# EAGLE design pi (EAGLE 9.4.2)

## Sheet 1 of 3
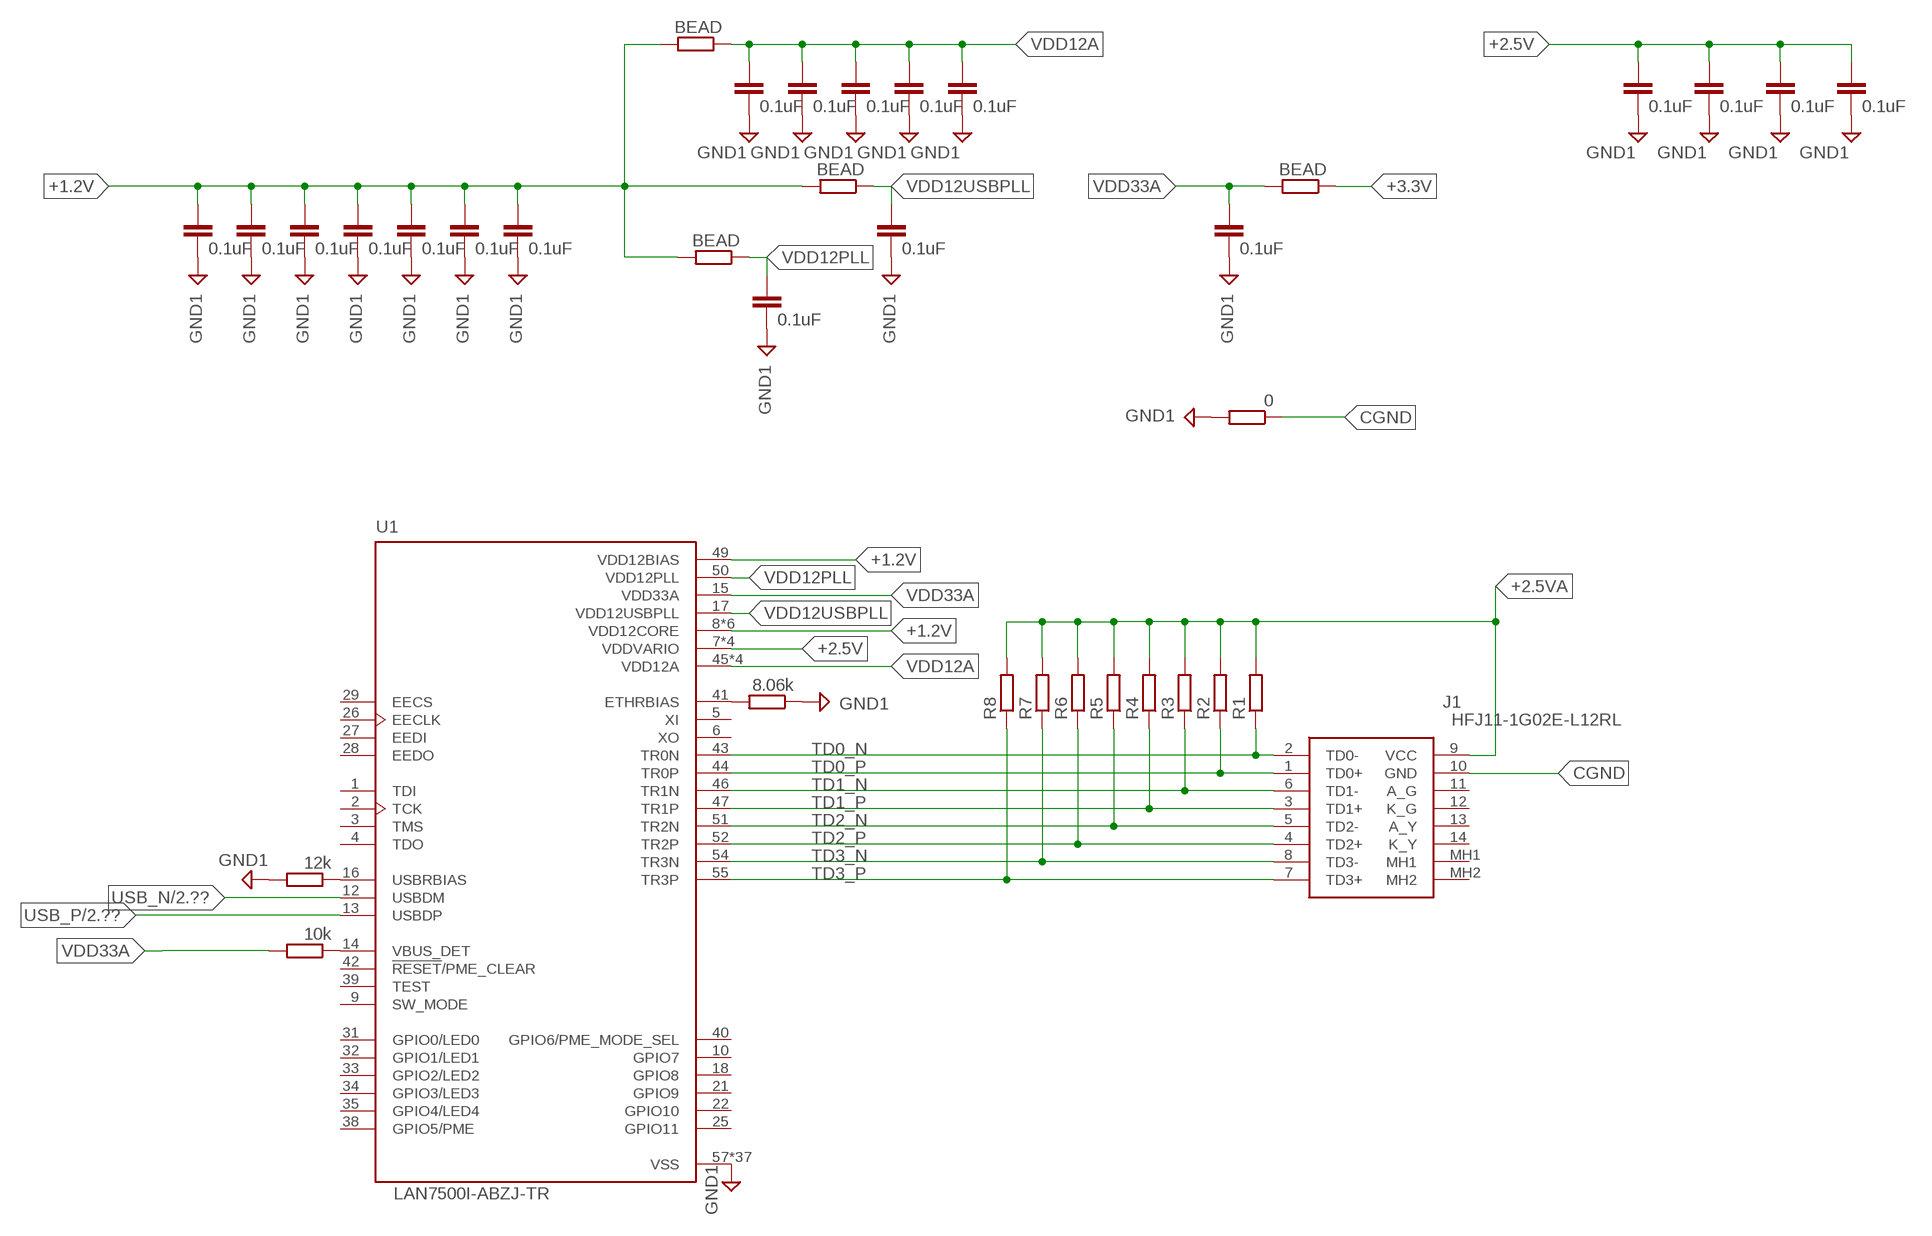
[diagram p0: schematic, sheet 1]

### Parts
C1  0.1uF  C-EUC0603K  [C0603K]
C2  0.1uF  C-EUC0603K  [C0603K]
C3  0.1uF  C-EUC0603K  [C0603K]
C4  0.1uF  C-EUC0603K  [C0603K]
C5  0.1uF  C-EUC0603K  [C0603K]
C6  0.1uF  C-EUC0603K  [C0603K]
C7  0.1uF  C-EUC0603K  [C0603K]
C8  0.1uF  C-EUC0603K  [C0603K]
C9  0.1uF  C-EUC0603K  [C0603K]
C10  0.1uF  C-EUC0603K  [C0603K]
C11  0.1uF  C-EUC0603K  [C0603K]
C12  0.1uF  C-EUC0603K  [C0603K]
C13  0.1uF  C-EUC0603K  [C0603K]
C14  0.1uF  C-EUC0603K  [C0603K]
C15  0.1uF  C-EUC0603K  [C0603K]
C16  0.1uF  C-EUC0603K  [C0603K]
C17  0.1uF  C-EUC0603K  [C0603K]
C18  0.1uF  C-EUC0603K  [C0603K]
C19  0.1uF  C-EUC0603K  [C0603K]
J1  HFJ11-1G02E-L12RL  [HFJ111G02EL12RL]
R1  R-EU_MELF0204R  [MINI_MELF-0204R]
R2  R-EU_MELF0204R  [MINI_MELF-0204R]
R3  R-EU_MELF0204R  [MINI_MELF-0204R]
R4  R-EU_MELF0204R  [MINI_MELF-0204R]
R5  R-EU_MELF0204R  [MINI_MELF-0204R]
R6  R-EU_MELF0204R  [MINI_MELF-0204R]
R7  R-EU_MELF0204R  [MINI_MELF-0204R]
R8  R-EU_MELF0204R  [MINI_MELF-0204R]
R9  8.06k  R-EU_MELF0204R  [MINI_MELF-0204R]
R10  12k  R-EU_MELF0204R  [MINI_MELF-0204R]
R11  10k  R-EU_MELF0204R  [MINI_MELF-0204R]
R12  BEAD  R-EU_MELF0204R  [MINI_MELF-0204R]
R13  BEAD  R-EU_MELF0204R  [MINI_MELF-0204R]
R14  BEAD  R-EU_MELF0204R  [MINI_MELF-0204R]
R15  0  R-EU_MELF0204R  [MINI_MELF-0204R]
R16  BEAD  R-EU_MELF0204R  [MINI_MELF-0204R]
U1  LAN7500I-ABZJ-TR  [QFN50P800X800X100-57N]

### Nets
+1.2V: C4.1 C5.1 C6.1 C7.1 C8.1 C9.1 C19.1 R12.2 R13.2 R16.2 U1.8(VDD12CORE) U1.11(VDD12CORE) U1.20(VDD12CORE) U1.23(VDD12CORE) U1.30(VDD12CORE) U1.36(VDD12CORE) U1.49(VDD12BIAS)
+2.5V: C15.1 C16.1 C17.1 C18.1 U1.7(VDDVARIO) U1.19(VDDVARIO) U1.24(VDDVARIO) U1.37(VDDVARIO)
+2.5VA: J1.9(VCC) R1.2 R2.2 R3.2 R4.2 R5.2 R6.2 R7.2 R8.2
+3.3V: R14.1
CGND: J1.10(GND) R15.1
GND1: C1.2 C2.2 C3.2 C4.2 C5.2 C6.2 C7.2 C8.2 C9.2 C10.2 C11.2 C12.2 C13.2 C14.2 C15.2 C16.2 C17.2 C18.2 C19.2 R9.1 R10.2 R15.2 U1.57(VSS) U1.V1(VSS) U1.V2(VSS) U1.V3(VSS) U1.V4(VSS) U1.V5(VSS) U1.V6(VSS) U1.V7(VSS) U1.V8(VSS) U1.V9(VSS) U1.V10(VSS) U1.V11(VSS) U1.V12(VSS) U1.V13(VSS) U1.V14(VSS) U1.V15(VSS) U1.V16(VSS) U1.V17(VSS) U1.V18(VSS) U1.V19(VSS) U1.V20(VSS) U1.V21(VSS) U1.V22(VSS) U1.V23(VSS) U1.V24(VSS) U1.V25(VSS) U1.V26(VSS) U1.V27(VSS) U1.V28(VSS) U1.V29(VSS) U1.V30(VSS) U1.V31(VSS) U1.V32(VSS) U1.V33(VSS) U1.V34(VSS) U1.V35(VSS) U1.V36(VSS)
N$1: R9.2 U1.41(ETHRBIAS)
N$2: R10.1 U1.16(USBRBIAS)
N$3: R11.1 U1.14(VBUS_DET)
TD0_N: J1.2(TD0-) R1.1 U1.43(TR0N)
TD0_P: J1.1(TD0+) R2.1 U1.44(TR0P)
TD1_N: J1.6(TD1-) R3.1 U1.46(TR1N)
TD1_P: J1.3(TD1+) R4.1 U1.47(TR1P)
TD2_N: J1.5(TD2-) R5.1 U1.51(TR2N)
TD2_P: J1.4(TD2+) R6.1 U1.52(TR2P)
TD3_N: J1.8(TD3-) R7.1 U1.54(TR3N)
TD3_P: J1.7(TD3+) R8.1 U1.55(TR3P)
USB_N: U1.12(USBDM) ; also sheet 2
USB_P: U1.13(USBDP) ; also sheet 2
VDD12A: C10.1 C11.1 C12.1 C13.1 C14.1 R16.1 U1.45(VDD12A) U1.48(VDD12A) U1.53(VDD12A) U1.56(VDD12A)
VDD12PLL: C2.1 R13.1 U1.50(VDD12PLL)
VDD12USBPLL: C1.1 R12.1 U1.17(VDD12USBPLL)
VDD33A: C3.1 R11.2 R14.2 U1.15(VDD33A)
Unconnected: J1.11(A_G) J1.12(K_G) J1.13(A_Y) J1.14(K_Y) J1.MH1 J1.MH2 U1.1(TDI) U1.2(TCK) U1.3(TMS) U1.4(TDO) U1.5(XI) U1.6(XO) U1.9(SW_MODE) U1.10(GPIO7) U1.18(GPIO8) U1.21(GPIO9) U1.22(GPIO10) U1.25(GPIO11) U1.26(EECLK) U1.27(EEDI) U1.28(EEDO) U1.29(EECS) U1.31(GPIO0/LED0) U1.32(GPIO1/LED1) U1.33(GPIO2/LED2) U1.34(GPIO3/LED3) U1.35(GPIO4/LED4) U1.38(GPIO5/PME) U1.39(TEST) U1.40(GPIO6/PME_MODE_SEL) U1.42(!RESET!/PME_CLEAR)

## Sheet 2 of 3
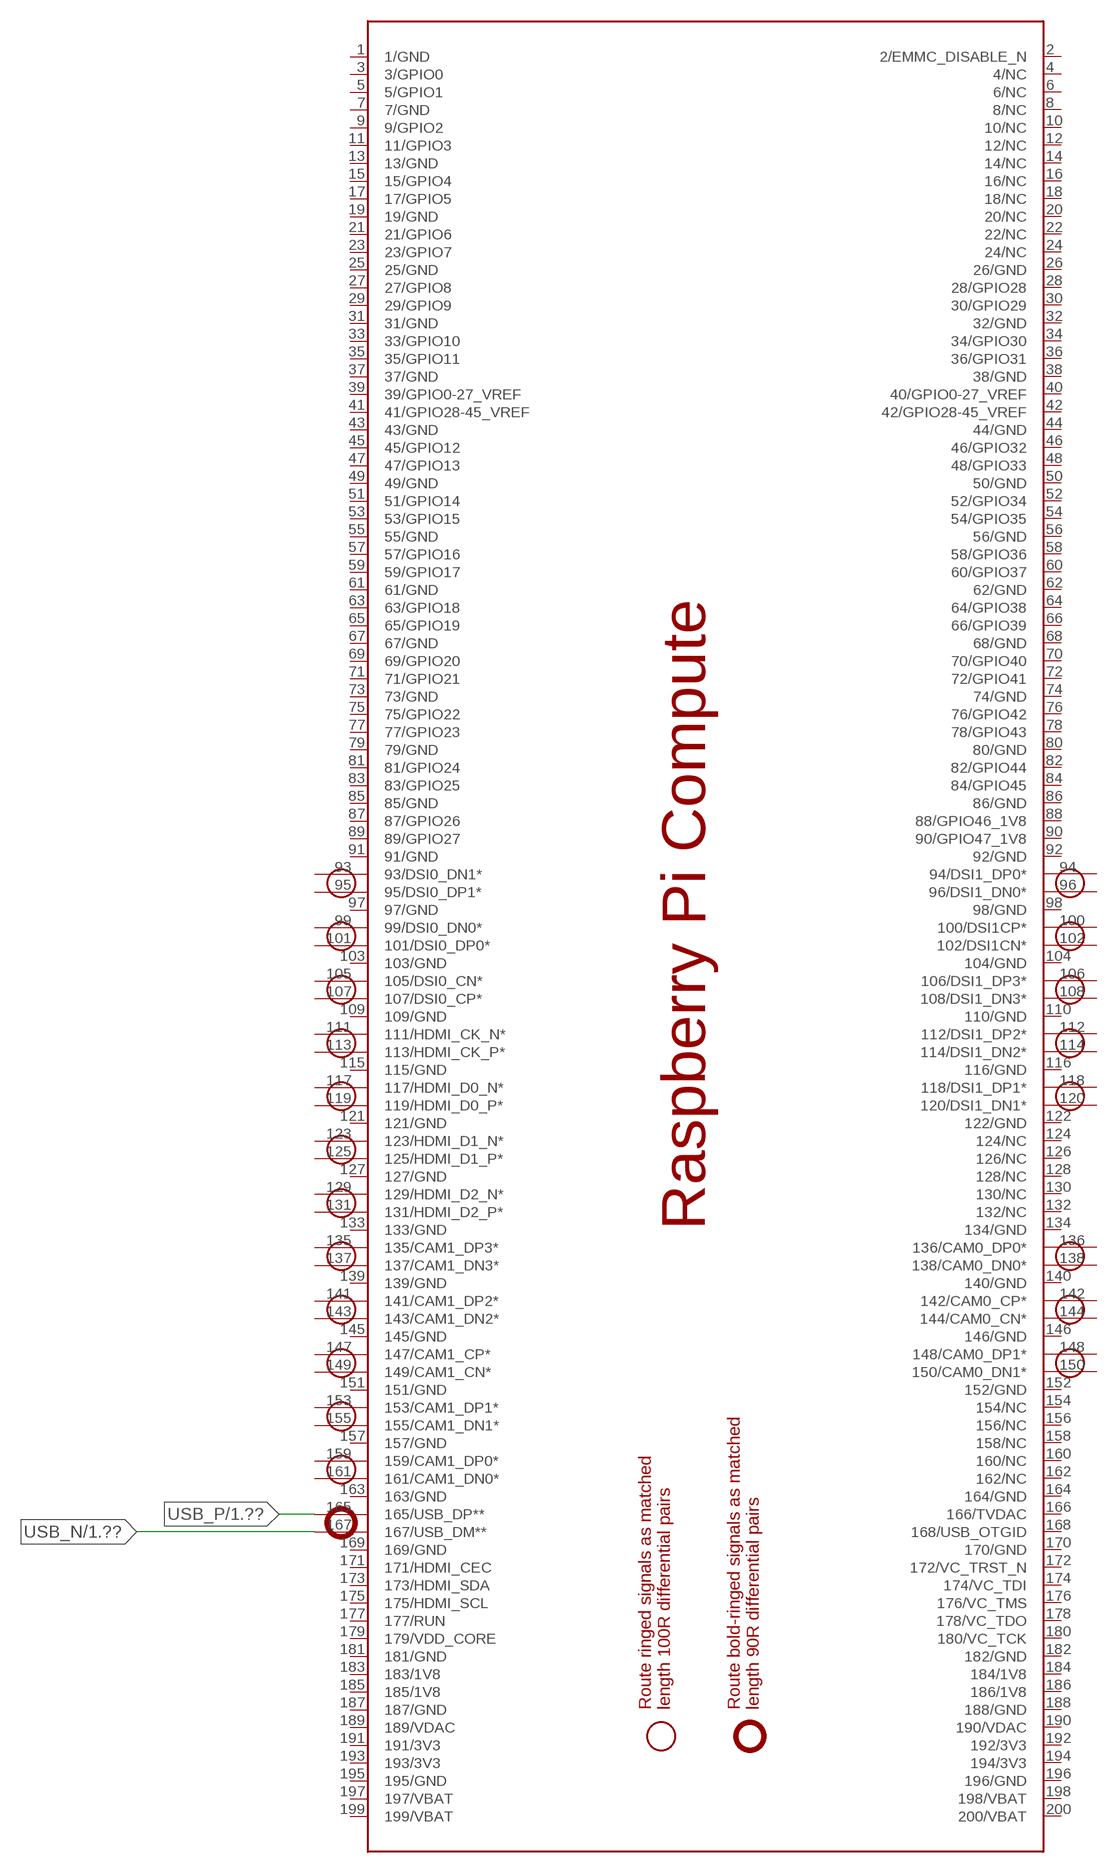
[diagram p1: schematic, sheet 2]

### Parts
PCB1  RPI_COMPUTE  [RPI_COMPUTE]

### Nets
USB_N: PCB1.167(167/USB_DM**) ; also sheet 1
USB_P: PCB1.165(165/USB_DP**) ; also sheet 1
Unconnected: PCB1.1(1/GND) PCB1.2(2/EMMC_DISABLE_N) PCB1.3(3/GPIO0) PCB1.4(4/NC) PCB1.5(5/GPIO1) PCB1.6(6/NC) PCB1.7(7/GND) PCB1.8(8/NC) PCB1.9(9/GPIO2) PCB1.10(10/NC) PCB1.11(11/GPIO3) PCB1.12(12/NC) PCB1.13(13/GND) PCB1.14(14/NC) PCB1.15(15/GPIO4) PCB1.16(16/NC) PCB1.17(17/GPIO5) PCB1.18(18/NC) PCB1.19(19/GND) PCB1.20(20/NC) PCB1.21(21/GPIO6) PCB1.22(22/NC) PCB1.23(23/GPIO7) PCB1.24(24/NC) PCB1.25(25/GND) PCB1.26(26/GND) PCB1.27(27/GPIO8) PCB1.28(28/GPIO28) PCB1.29(29/GPIO9) PCB1.30(30/GPIO29) PCB1.31(31/GND) PCB1.32(32/GND) PCB1.33(33/GPIO10) PCB1.34(34/GPIO30) PCB1.35(35/GPIO11) PCB1.36(36/GPIO31) PCB1.37(37/GND) PCB1.38(38/GND) PCB1.39(39/GPIO0-27_VREF) PCB1.40(40/GPIO0-27_VREF) PCB1.41(41/GPIO28-45_VREF) PCB1.42(42/GPIO28-45_VREF) PCB1.43(43/GND) PCB1.44(44/GND) PCB1.45(45/GPIO12) PCB1.46(46/GPIO32) PCB1.47(47/GPIO13) PCB1.48(48/GPIO33) PCB1.49(49/GND) PCB1.50(50/GND) PCB1.51(51/GPIO14) PCB1.52(52/GPIO34) PCB1.53(53/GPIO15) PCB1.54(54/GPIO35) PCB1.55(55/GND) PCB1.56(56/GND) PCB1.57(57/GPIO16) PCB1.58(58/GPIO36) PCB1.59(59/GPIO17) PCB1.60(60/GPIO37) PCB1.61(61/GND) PCB1.62(62/GND) PCB1.63(63/GPIO18) PCB1.64(64/GPIO38) PCB1.65(65/GPIO19) PCB1.66(66/GPIO39) PCB1.67(67/GND) PCB1.68(68/GND) PCB1.69(69/GPIO20) PCB1.70(70/GPIO40) PCB1.71(71/GPIO21) PCB1.72(72/GPIO41) PCB1.73(73/GND) PCB1.74(74/GND) PCB1.75(75/GPIO22) PCB1.76(76/GPIO42) PCB1.77(77/GPIO23) PCB1.78(78/GPIO43) PCB1.79(79/GND) PCB1.80(80/GND) PCB1.81(81/GPIO24) PCB1.82(82/GPIO44) PCB1.83(83/GPIO25) PCB1.84(84/GPIO45) PCB1.85(85/GND) PCB1.86(86/GND) PCB1.87(87/GPIO26) PCB1.88(88/GPIO46_1V8) PCB1.89(89/GPIO27) PCB1.90(90/GPIO47_1V8) PCB1.91(91/GND) PCB1.92(92/GND) PCB1.93(93/DSI0_DN1*) PCB1.94(94/DSI1_DP0*) PCB1.95(95/DSI0_DP1*) PCB1.96(96/DSI1_DN0*) PCB1.97(97/GND) PCB1.98(98/GND) PCB1.99(99/DSI0_DN0*) PCB1.100(100/DSI1CP*) PCB1.101(101/DSI0_DP0*) PCB1.102(102/DSI1CN*) PCB1.103(103/GND) PCB1.104(104/GND) PCB1.105(105/DSI0_CN*) PCB1.106(106/DSI1_DP3*) PCB1.107(107/DSI0_CP*) PCB1.108(108/DSI1_DN3*) PCB1.109(109/GND) PCB1.110(110/GND) PCB1.111(111/HDMI_CK_N*) PCB1.112(112/DSI1_DP2*) PCB1.113(113/HDMI_CK_P*) PCB1.114(114/DSI1_DN2*) PCB1.115(115/GND) PCB1.116(116/GND) PCB1.117(117/HDMI_D0_N*) PCB1.118(118/DSI1_DP1*) PCB1.119(119/HDMI_D0_P*) PCB1.120(120/DSI1_DN1*) PCB1.121(121/GND) PCB1.122(122/GND) PCB1.123(123/HDMI_D1_N*) PCB1.124(124/NC) PCB1.125(125/HDMI_D1_P*) PCB1.126(126/NC) PCB1.127(127/GND) PCB1.128(128/NC) PCB1.129(129/HDMI_D2_N*) PCB1.130(130/NC) PCB1.131(131/HDMI_D2_P*) PCB1.132(132/NC) PCB1.133(133/GND) PCB1.134(134/GND) PCB1.135(135/CAM1_DP3*) PCB1.136(136/CAM0_DP0*) PCB1.137(137/CAM1_DN3*) PCB1.138(138/CAM0_DN0*) PCB1.139(139/GND) PCB1.140(140/GND) PCB1.141(141/CAM1_DP2*) PCB1.142(142/CAM0_CP*) PCB1.143(143/CAM1_DN2*) PCB1.144(144/CAM0_CN*) PCB1.145(145/GND) PCB1.146(146/GND) PCB1.147(147/CAM1_CP*) PCB1.148(148/CAM0_DP1*) PCB1.149(149/CAM1_CN*) PCB1.150(150/CAM0_DN1*) PCB1.151(151/GND) PCB1.152(152/GND) PCB1.153(153/CAM1_DP1*) PCB1.154(154/NC) PCB1.155(155/CAM1_DN1*) PCB1.156(156/NC) PCB1.157(157/GND) PCB1.158(158/NC) PCB1.159(159/CAM1_DP0*) PCB1.160(160/NC) PCB1.161(161/CAM1_DN0*) PCB1.162(162/NC) PCB1.163(163/GND) PCB1.164(164/GND) PCB1.166(166/TVDAC) PCB1.168(168/USB_OTGID) PCB1.169(169/GND) PCB1.170(170/GND) PCB1.171(171/HDMI_CEC) PCB1.172(172/VC_TRST_N) PCB1.173(173/HDMI_SDA) PCB1.174(174/VC_TDI) PCB1.175(175/HDMI_SCL) PCB1.176(176/VC_TMS) PCB1.177(177/RUN) PCB1.178(178/VC_TDO) PCB1.179(179/VDD_CORE) PCB1.180(180/VC_TCK) PCB1.181(181/GND) PCB1.182(182/GND) PCB1.183(183/1V8) PCB1.184(184/1V8) PCB1.185(185/1V8) PCB1.186(186/1V8) PCB1.187(187/GND) PCB1.188(188/GND) PCB1.189(189/VDAC) PCB1.190(190/VDAC) PCB1.191(191/3V3) PCB1.192(192/3V3) PCB1.193(193/3V3) PCB1.194(194/3V3) PCB1.195(195/GND) PCB1.196(196/GND) PCB1.197(197/VBAT) PCB1.198(198/VBAT) PCB1.199(199/VBAT) PCB1.200(200/VBAT)

## Sheet 3 of 3
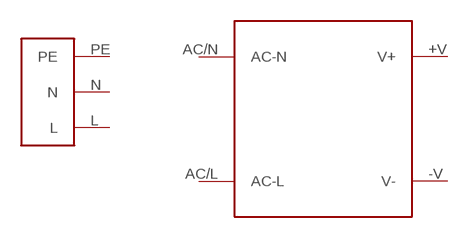
[diagram p2: schematic, sheet 3]

### Parts
U$1  DD21  [DD21.NOCOVER]
U$2  IRM-15-5  [IRM-15]
Unconnected: U$1.L U$1.N U$1.PE U$2.+V(V+) U$2.-V(V-) U$2.AC/L(AC-L) U$2.AC/N(AC-N)

## Library data of the parts
C1-C19 = Vwvwbg:C-EU: CAPACITOR, European symbol
J1 = Vwvwbg:HFJ11-1G02E-L12RL: Modular Connectors / Ethernet Connectors GIGABIT 1x1 Tab Down RJ45 w/mag Y/G LED Source: Datasheet <https://componentsearchengine.com/Datasheets/1/HFJ11-1G02E-L12RL.pdf>; ARROW_PART_NUMBER: HFJ11-1G02E-L12RL; DESCRIPTION: Modular Connectors / Ethernet Connectors GIGABIT 1x1 Tab Down RJ45 w/mag Y/G LED; HEIGHT: 13.64mm; MANUFACTURER_NAME: Halo Electronics; MANUFACTURER_PART_NUMBER: HFJ11-1G02E-L12RL; MOUSER_PART_NUMBER: 493-HFJ111G02EL12RL; MOUSER_PRICE-STOCK: https://www.mouser.co.uk/ProductDetail/HALO-Electronics/HFJ11-1G02E-L12RL?qs=8uu3sA0mUduADOHhIelkvg%3D%3D
PCB1 = Vwvwbg:RPI_COMPUTE: Device for a Raspberry PI Compute module. Note that the package is for a DDR2 connector of 'standard' orientation. Example: TE Connectivity P/N: 1565917-4, Newark P/N: 08P0616, Farnell P/N: 2112525 More information is available at http://www.element14.com/community/community/raspberry-pi/raspberry-pi-compute-module
R1-R16 = Vwvwbg:R-EU_: RESISTOR, European symbol
U1 = Vwvwbg:LAN7500I-ABZJ-TR: Hi-Speed USB 2.0 to 10/100/1000 Ethernet, 56 VQFN 8x8x0.9mm T/R; AVAILABILITY: Unavailable; DESCRIPTION: Ethernet Bridge, USB to Ethernet USB 2.0, 10/100/1000 Base-T/TX USB Interface 56-QFN (8x8); MF: Microchip; MP: LAN7500I-ABZJ-TR; PACKAGE: QFN-56 Microchip; PRICE: None
U$1 = Vwvwbg:DD21
U$2 = Vwvwbg:IRM-15-5

## Board
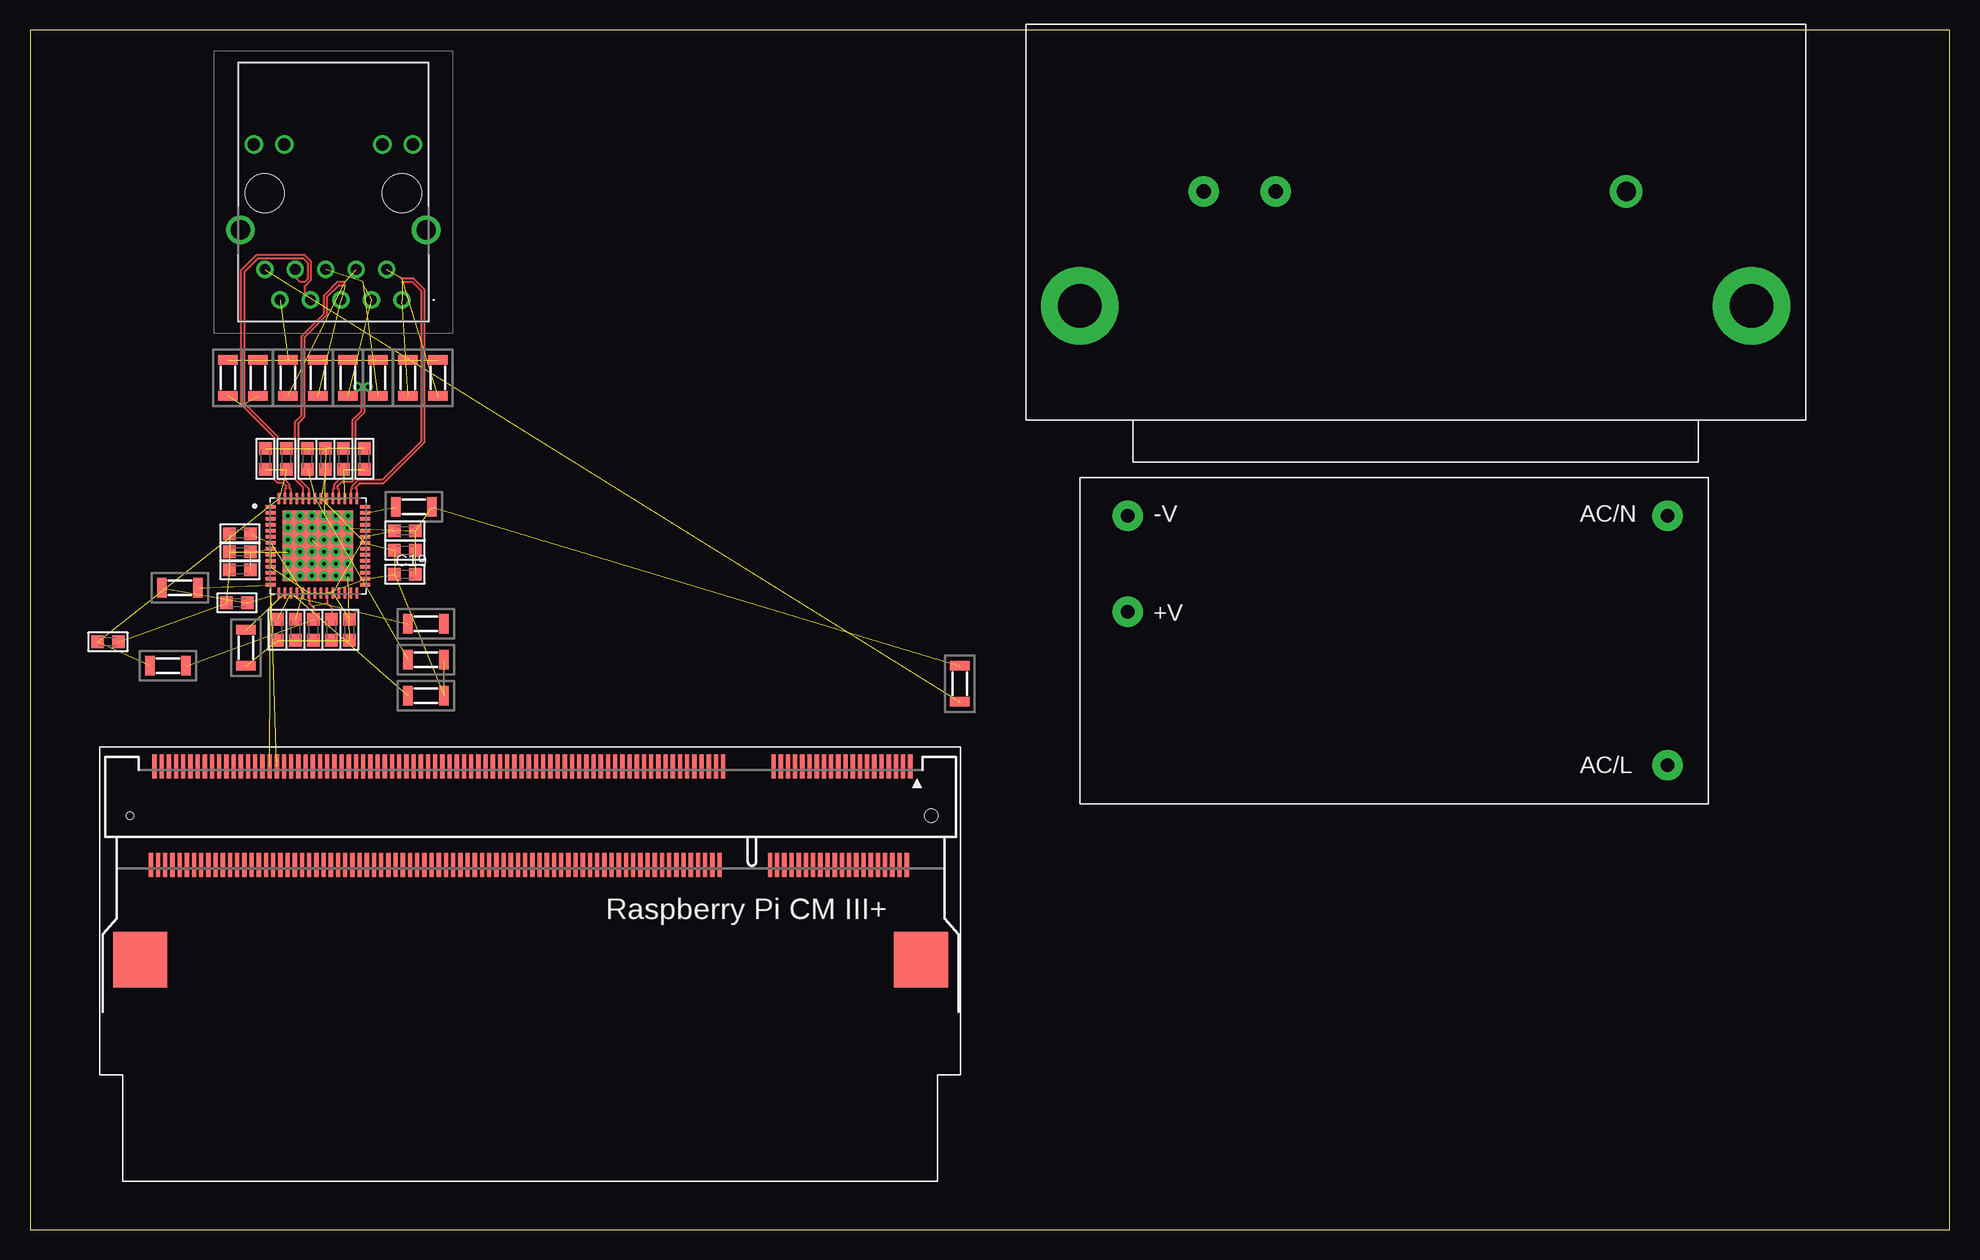
[diagram p3: board, top side]
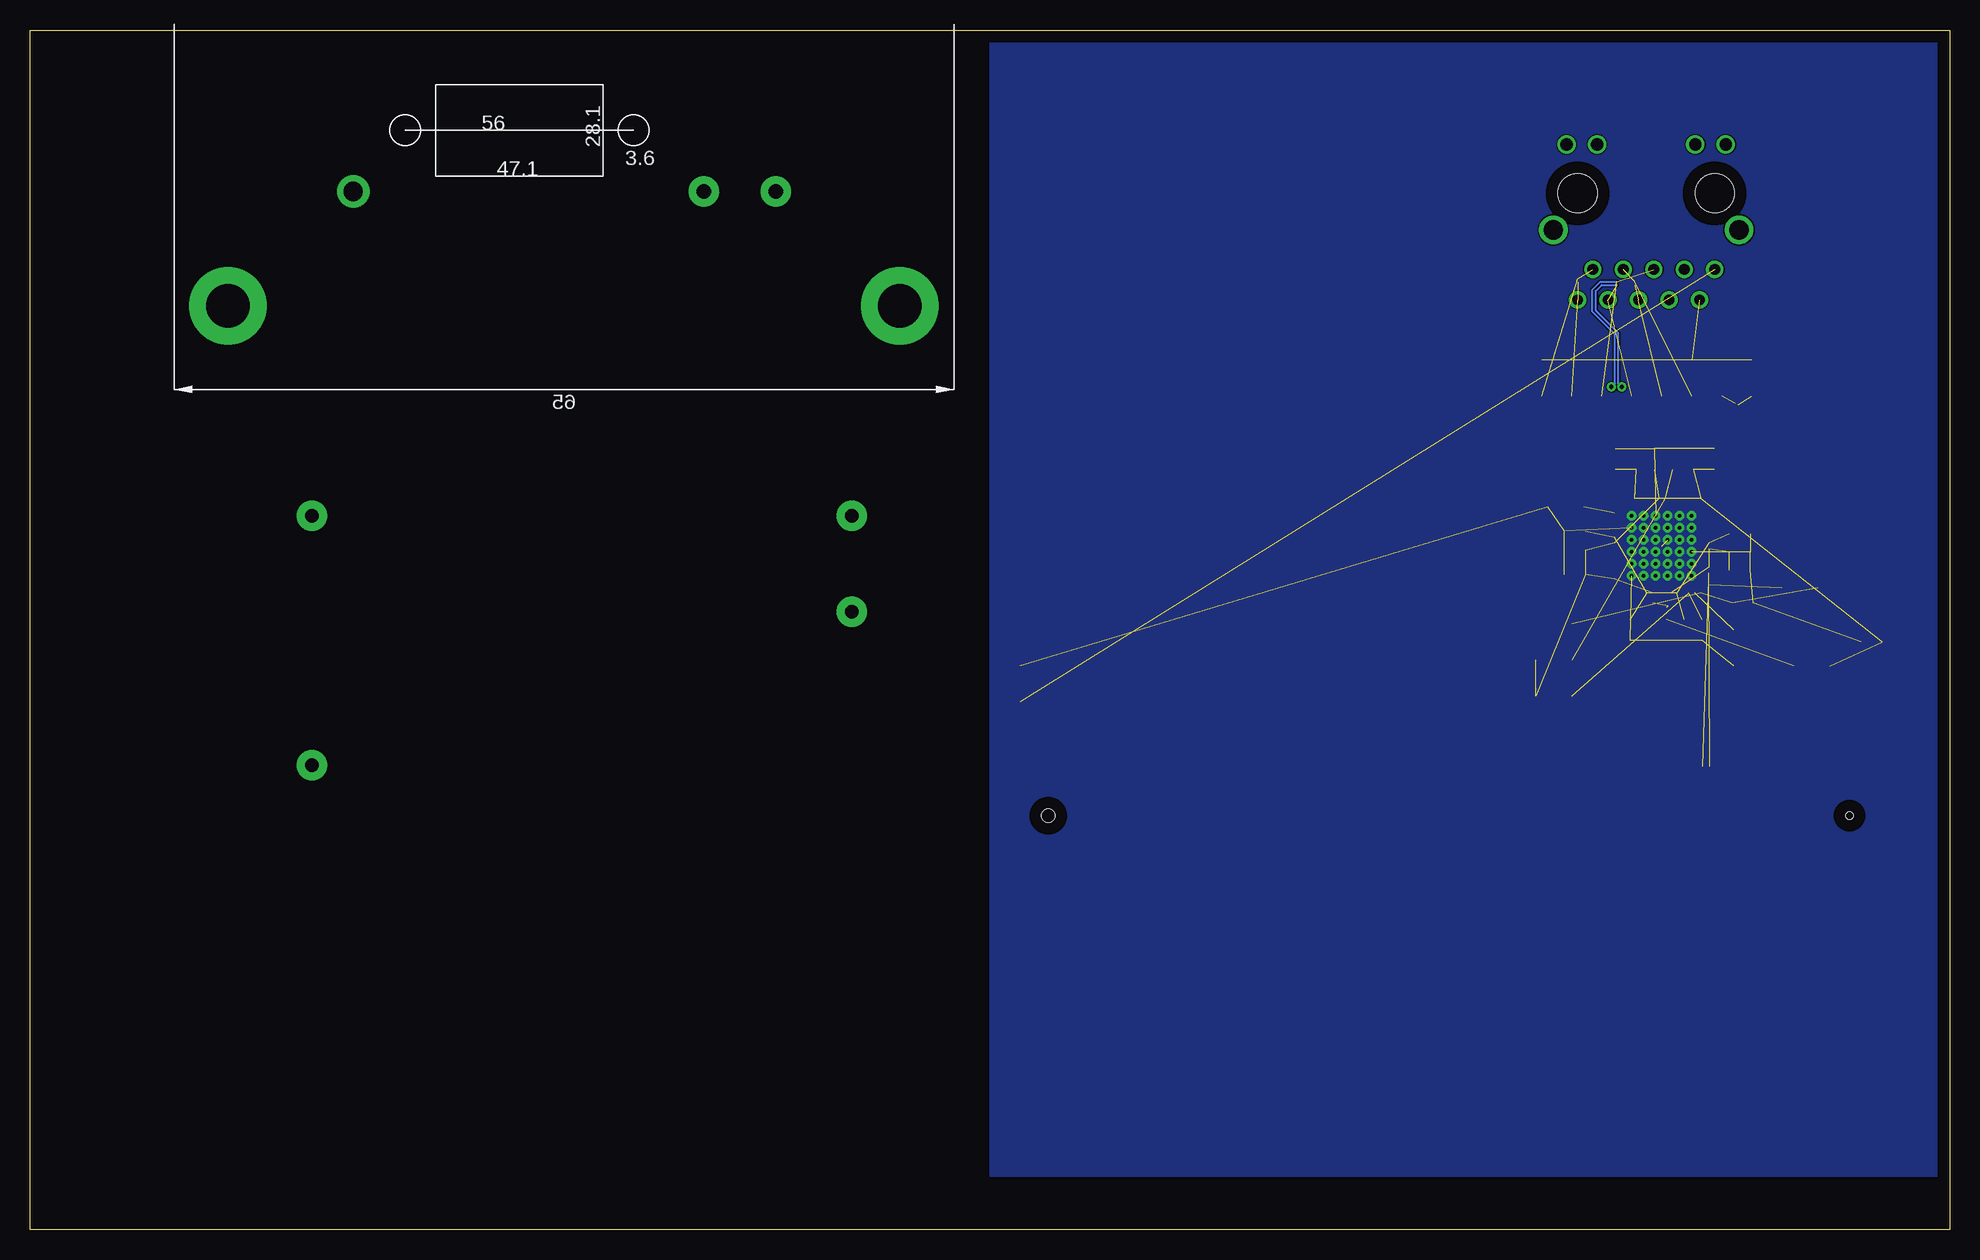
[diagram p4: board, bottom side, seen from below]

Size 160 x 100 mm. Coordinates in mm from the lower left corner, seen from the top.
Outline: 0,0 160,0 160,100 0,100 0,0
Copper layers (1*16): Top 0.035mm / dielectric 0.15mm / Bottom 0.035mm
Design rules "default *": minimum track width 6mil, minimum drill 0.35mm, track to track 4mil, track to pad 4mil, pad to pad 4mil, via to via 4mil, smd to smd 4mil, copper to edge 40mil, drill to drill 6mil, minimum pad ring 10mil, minimum via ring 8mil, stop-mask expansion 4mil, vias tented up to drill 0mil, thermal gap 10mil

### Footprints (pad centres in the part's own frame; a part is rotated, then mirrored left to right if it is on the bottom)
C0603K = smd 1.05 x 1.08: 1 -0.875,0; 2 0.875,0
HFJ111G02EL12RL = drill 0.89 pad 1.446: 1 0,0; 2 1.27,-2.54; 3 2.54,0; 4 3.81,-2.54; 5 5.08,0; 6 6.35,-2.54; 7 7.62,0; 8 8.89,-2.54; 9 10.16,0; 10 11.43,-2.54 | drill 1.02 pad 1.53: 11 -0.915,-12.95; 12 1.625,-12.95; 13 9.805,-12.95; 14 12.345,-12.95 | drill 1.6 pad 2.4: MH1 -2.03,-5.84; MH2 13.46,-5.84 | hole 3.25: 0,-8.89; 11.43,-8.89
RPI_COMPUTE = smd 0.35 x 2: 1 -31.38,-4.1; 2 -31.08,4.1; 3 -30.78,-4.1; 4 -30.48,4.1; 5 -30.18,-4.1; 6 -29.88,4.1; 7 -29.58,-4.1; 8 -29.28,4.1; 9 -28.98,-4.1; 10 -28.68,4.1; 11 -28.38,-4.1; 12 -28.08,4.1; 13 -27.78,-4.1; 14 -27.48,4.1; 15 -27.18,-4.1; 16 -26.88,4.1; 17 -26.58,-4.1; 18 -26.28,4.1; 19 -25.98,-4.1; 20 -25.68,4.1; 21 -25.38,-4.1; 22 -25.08,4.1; 23 -24.78,-4.1; 24 -24.48,4.1; 25 -24.18,-4.1; 26 -23.88,4.1; 27 -23.58,-4.1; 28 -23.28,4.1; 29 -22.98,-4.1; 30 -22.68,4.1; 31 -22.38,-4.1; 32 -22.08,4.1; 33 -21.78,-4.1; 34 -21.48,4.1; 35 -21.18,-4.1; 36 -20.88,4.1; 37 -20.58,-4.1; 38 -20.28,4.1; 39 -19.98,-4.1; 40 -19.68,4.1; 41 -15.78,-4.1; 42 -15.48,4.1; 43 -15.18,-4.1; 44 -14.88,4.1; 45 -14.58,-4.1; 46 -14.28,4.1; 47 -13.98,-4.1; 48 -13.68,4.1; 49 -13.38,-4.1; 50 -13.08,4.1; 51 -12.78,-4.1; 52 -12.48,4.1; 53 -12.18,-4.1; 54 -11.88,4.1; 55 -11.58,-4.1; 56 -11.28,4.1; 57 -10.98,-4.1; 58 -10.68,4.1; 59 -10.38,-4.1; 60 -10.08,4.1; 61 -9.78,-4.1; 62 -9.48,4.1; 63 -9.18,-4.1; 64 -8.88,4.1; 65 -8.58,-4.1; 66 -8.28,4.1; 67 -7.98,-4.1; 68 -7.68,4.1; 69 -7.38,-4.1; 70 -7.08,4.1; 71 -6.78,-4.1; 72 -6.48,4.1; 73 -6.18,-4.1; 74 -5.88,4.1; 75 -5.58,-4.1; 76 -5.28,4.1; 77 -4.98,-4.1; 78 -4.68,4.1; 79 -4.38,-4.1; 80 -4.08,4.1; 81 -3.78,-4.1; 82 -3.48,4.1; 83 -3.18,-4.1; 84 -2.88,4.1; 85 -2.58,-4.1; 86 -2.28,4.1; 87 -1.98,-4.1; 88 -1.68,4.1; 89 -1.38,-4.1; 90 -1.08,4.1; 91 -0.78,-4.1; 92 -0.48,4.1; 93 -0.18,-4.1; 94 0.12,4.1; 95 0.42,-4.1; 96 0.72,4.1; 97 1.02,-4.1; 98 1.32,4.1; 99 1.62,-4.1; 100 1.92,4.1; 101 2.22,-4.1; 102 2.52,4.1; 103 2.82,-4.1; 104 3.12,4.1; 105 3.42,-4.1; 106 3.72,4.1; 107 4.02,-4.1; 108 4.32,4.1; 109 4.62,-4.1; 110 4.92,4.1; 111 5.22,-4.1; 112 5.52,4.1; 113 5.82,-4.1; 114 6.12,4.1; 115 6.42,-4.1; 116 6.72,4.1; 117 7.02,-4.1; 118 7.32,4.1; 119 7.62,-4.1; 120 7.92,4.1; 121 8.22,-4.1; 122 8.52,4.1; 123 8.82,-4.1; 124 9.12,4.1; 125 9.42,-4.1; 126 9.72,4.1; 127 10.02,-4.1; 128 10.32,4.1; 129 10.62,-4.1; 130 10.92,4.1; 131 11.22,-4.1; 132 11.52,4.1; 133 11.82,-4.1; 134 12.12,4.1; 135 12.42,-4.1; 136 12.72,4.1; 137 13.02,-4.1; 138 13.32,4.1; 139 13.62,-4.1; 140 13.92,4.1; 141 14.22,-4.1; 142 14.52,4.1; 143 14.82,-4.1; 144 15.12,4.1; 145 15.42,-4.1; 146 15.72,4.1; 147 16.02,-4.1; 148 16.32,4.1; 149 16.62,-4.1; 150 16.92,4.1; 151 17.22,-4.1; 152 17.52,4.1; 153 17.82,-4.1; 154 18.12,4.1; 155 18.42,-4.1; 156 18.72,4.1; 157 19.02,-4.1; 158 19.32,4.1; 159 19.62,-4.1; 160 19.92,4.1; 161 20.22,-4.1; 162 20.52,4.1; 163 20.82,-4.1; 164 21.12,4.1; 165 21.42,-4.1; 166 21.72,4.1; 167 22.02,-4.1; 168 22.32,4.1; 169 22.62,-4.1; 170 22.92,4.1; 171 23.22,-4.1; 172 23.52,4.1; 173 23.82,-4.1; 174 24.12,4.1; 175 24.42,-4.1; 176 24.72,4.1; 177 25.02,-4.1; 178 25.32,4.1; 179 25.62,-4.1; 180 25.92,4.1; 181 26.22,-4.1; 182 26.52,4.1; 183 26.82,-4.1; 184 27.12,4.1; 185 27.42,-4.1; 186 27.72,4.1; 187 28.02,-4.1; 188 28.32,4.1; 189 28.62,-4.1; 190 28.92,4.1; 191 29.22,-4.1; 192 29.52,4.1; 193 29.82,-4.1; 194 30.12,4.1; 195 30.42,-4.1; 196 30.72,4.1; 197 31.02,-4.1; 198 31.32,4.1; 199 31.62,-4.1; 200 31.92,4.1 | smd 4.5 x 4.6: M1 -32.28,12; M2 32.82,12 | hole 1.1: -33.13,0 | hole 0.6: 33.67,0
MINI_MELF-0204R = smd 0.8 x 1.6: 1 -1.5,0; 2 1.5,0
QFN50P800X800X100-57N = smd 0.88 x 0.26: 1 -3.94,3.25; 2 -3.94,2.75; 3 -3.94,2.25; 4 -3.94,1.75; 5 -3.94,1.25; 6 -3.94,0.75; 7 -3.94,0.25; 8 -3.94,-0.25; 9 -3.94,-0.75; 10 -3.94,-1.25; 11 -3.94,-1.75; 12 -3.94,-2.25; 13 -3.94,-2.75; 14 -3.94,-3.25; 29 3.94,-3.25; 30 3.94,-2.75; 31 3.94,-2.25; 32 3.94,-1.75; 33 3.94,-1.25; 34 3.94,-0.75; 35 3.94,-0.25; 36 3.94,0.25; 37 3.94,0.75; 38 3.94,1.25; 39 3.94,1.75; 40 3.94,2.25; 41 3.94,2.75; 42 3.94,3.25 | smd 0.26 x 0.88: 15 -3.25,-3.94; 16 -2.75,-3.94; 17 -2.25,-3.94; 18 -1.75,-3.94; 19 -1.25,-3.94; 20 -0.75,-3.94; 21 -0.25,-3.94; 22 0.25,-3.94; 23 0.75,-3.94; 24 1.25,-3.94; 25 1.75,-3.94; 26 2.25,-3.94; 27 2.75,-3.94; 28 3.25,-3.94; 43 3.25,3.94; 44 2.75,3.94; 45 2.25,3.94; 46 1.75,3.94; 47 1.25,3.94; 48 0.75,3.94; 49 0.25,3.94; 50 -0.25,3.94; 51 -0.75,3.94; 52 -1.25,3.94; 53 -1.75,3.94; 54 -2.25,3.94; 55 -2.75,3.94; 56 -3.25,3.94 | smd 5.9 x 5.9: 57 0,0 | drill 0.3 pad 0.4: V1 -2.5,2.5; V2 -2.5,1.5; V3 -2.5,0.5; V4 -2.5,-0.5; V5 -2.5,-1.5; V6 -2.5,-2.5; V7 -1.5,2.5; V8 -1.5,1.5; V9 -1.5,0.5; V10 -1.5,-0.5; V11 -1.5,-1.5; V12 -1.5,-2.5; V13 -0.5,2.5; V14 -0.5,1.5; V15 -0.5,0.5; V16 -0.5,-0.5; V17 -0.5,-1.5; V18 -0.5,-2.5; V19 0.5,2.5; V20 0.5,1.5; V21 0.5,0.5; V22 0.5,-0.5; V23 0.5,-1.5; V24 0.5,-2.5; V25 1.5,2.5; V26 1.5,1.5; V27 1.5,0.5; V28 1.5,-0.5; V29 1.5,-1.5; V30 1.5,-2.5; V31 2.5,2.5; V32 2.5,1.5; V33 2.5,0.5; V34 2.5,-0.5; V35 2.5,-1.5; V36 2.5,-2.5
DD21.NOCOVER = drill 1.2 pad 2.54: L -17.65,19.05; N -11.65,19.05 | drill 3.6 pad 6.452: P$1 -28,9.5; P$2 28,9.5 | drill 1.6 pad 2.7: PE 17.55,19.05
IRM-15 = drill 1.1 pad 2.54: +V 4,16; -V 4,24; AC/L 49,3.2; AC/N 49,24

### Placement (x,y rotation side)
C1  20.62,50 270 top
C2  23.12,64.25 90 top
C3  17.25,52.25 180 top
C4  23.62,50 270 top
C5  25.12,50 270 top
C6  31.25,56.62 0 top
C7  17.5,56.5 180 top
C8  17.5,55 180 top
C9  24.62,64.25 90 top
C10  21.38,64.25 90 top
C11  19.62,64.25 90 top
C12  26.12,64.25 90 top
C13  27.88,64.25 90 top
C14  6.5,49 0 top
C15  31.25,58.25 0 top
C16  26.62,50 270 top
C17  22.12,50 270 top
C18  17.5,58 180 top
C19  31.25,54.62 0 top
J1  31,77.5 180 top
PCB1  42,34.5 180 top
R1  34,71 90 top
R2  31.5,71 90 top
R3  29,71 90 top
R4  26.5,71 90 top
R5  24,71 90 top
R6  21.5,71 90 top
R7  19,71 90 top
R8  16.5,71 90 top
R9  32,60.25 180 top
R10  18,48.5 270 top
R11  12.5,53.5 180 top
R12  33,44.5 0 top
R13  33,47.5 0 top
R14  33,50.5 180 top
R15  77.5,45.5 90 top
R16  11.5,47 0 top
U1  24,57 0 top
U$1  115.5,67.5 0 top
U$2  87.5,35.5 0 top

### Tracks (layer width: path | path; a pad name or v marks a point on that pad's centre or on a via)
+1.2V  (15 unrouted)
  Top 0.152: U1.23 24.75,52.25 25.12,51.88 C5.1 | U1.20 23.25,52.25 23.62,51.88 C4.1
+2.5V  (7 unrouted)
+2.5VA  (8 unrouted)
CGND  (1 unrouted)
GND1  (23 unrouted)
  pour Bottom (no thermals): -0.5,101 80,101 80,4.5 -0.5,4.5
N$1  (1 unrouted)
N$2  (1 unrouted)
N$3  (1 unrouted)
TD0_N  (2 unrouted)
  Top 0.152: U1.43 27.25,61.69 27.13,61.81 27.13,61.88 27.5,62.25 29.48,62.25 32.88,65.64 32.88,78.36 31.98,79.25 31,79.25
TD0_P  (2 unrouted)
  Top 0.152: U1.44 26.75,61.69 26.87,61.81 26.87,61.98 27.4,62.5 29.38,62.5 32.62,65.75 32.62,78.25 31.88,79 31,79
TD1_N  (via drill 0.35)  (2 unrouted)
  Top 0.152: U1.46 25.75,61.69 25.63,61.81 25.63,62 26,62.38 26.86,62.38 27.13,62.65 27.13,67.38 27.88,68.13 27.88,69.95 v28.18,70.25
  Bottom 0.152: v28.18,70.25 27.88,70.55 27.88,74.63 29.75,76.5 29.75,78.36 29.11,79 27.75,79
TD1_P  (via drill 0.35)  (2 unrouted)
  Top 0.152: U1.47 25.25,61.69 25.37,61.81 25.37,62.1 25.9,62.63 26.75,62.63 26.88,62.75 26.88,67.48 27.62,68.23 27.62,69.95 v27.32,70.25
  Bottom 0.152: v27.32,70.25 27.62,70.55 27.62,74.73 29.5,76.61 29.5,78.25 29,78.75 27.75,78.75
TD2_N  (2 unrouted)
  Top 0.152: U1.51 23.25,61.73 22.38,62.61 22.38,67.25 22.88,67.75 22.88,74.38 24.75,76.25 24.75,77.75 25.75,78.75 26.25,78.75
TD2_P  (2 unrouted)
  Top 0.152: U1.52 22.75,61.88 22.12,62.5 22.12,67.36 22.62,67.86 22.62,74.48 24.5,76.36 24.5,77.86 25.64,79 26.25,79
TD3_N  (1 unrouted)
  Top 0.152: U1.54 21.75,61.69 21.63,61.81 21.63,62.1 21.23,62.5 20.75,62.5 20.62,62.62 20.62,66.11 17.88,68.86 17.88,79.88 19,81 22.75,81 23.12,80.62 23.12,79.25 22.88,79 22.5,79 22.11,79.39 J1.8
TD3_P  (1 unrouted)
  Top 0.152: U1.55 21.25,61.69 21.37,61.81 21.37,62 21.12,62.25 20.64,62.25 20.37,62.52 20.37,66 17.62,68.75 17.62,79.98 18.89,81.25 22.86,81.25 23.38,80.73 23.38,79.13 22.88,78.62 22.88,78 J1.7
USB_N  (1 unrouted)
USB_P  (1 unrouted)
VDD12A  (9 unrouted)
VDD12PLL  (2 unrouted)
VDD12USBPLL  (2 unrouted)
VDD33A  (3 unrouted)